# Altium schematic sheet MCU_STM32F446RE.SchDoc: STM32F446 CNC
size C; Author: AM; CompanyName: Expatria Technologies; DrawnBy: A.Marles; Engineer: AM; Organization: Expatria Technologies; DocumentNumber: 3; SheetNumber: 3; SheetTotal: 14
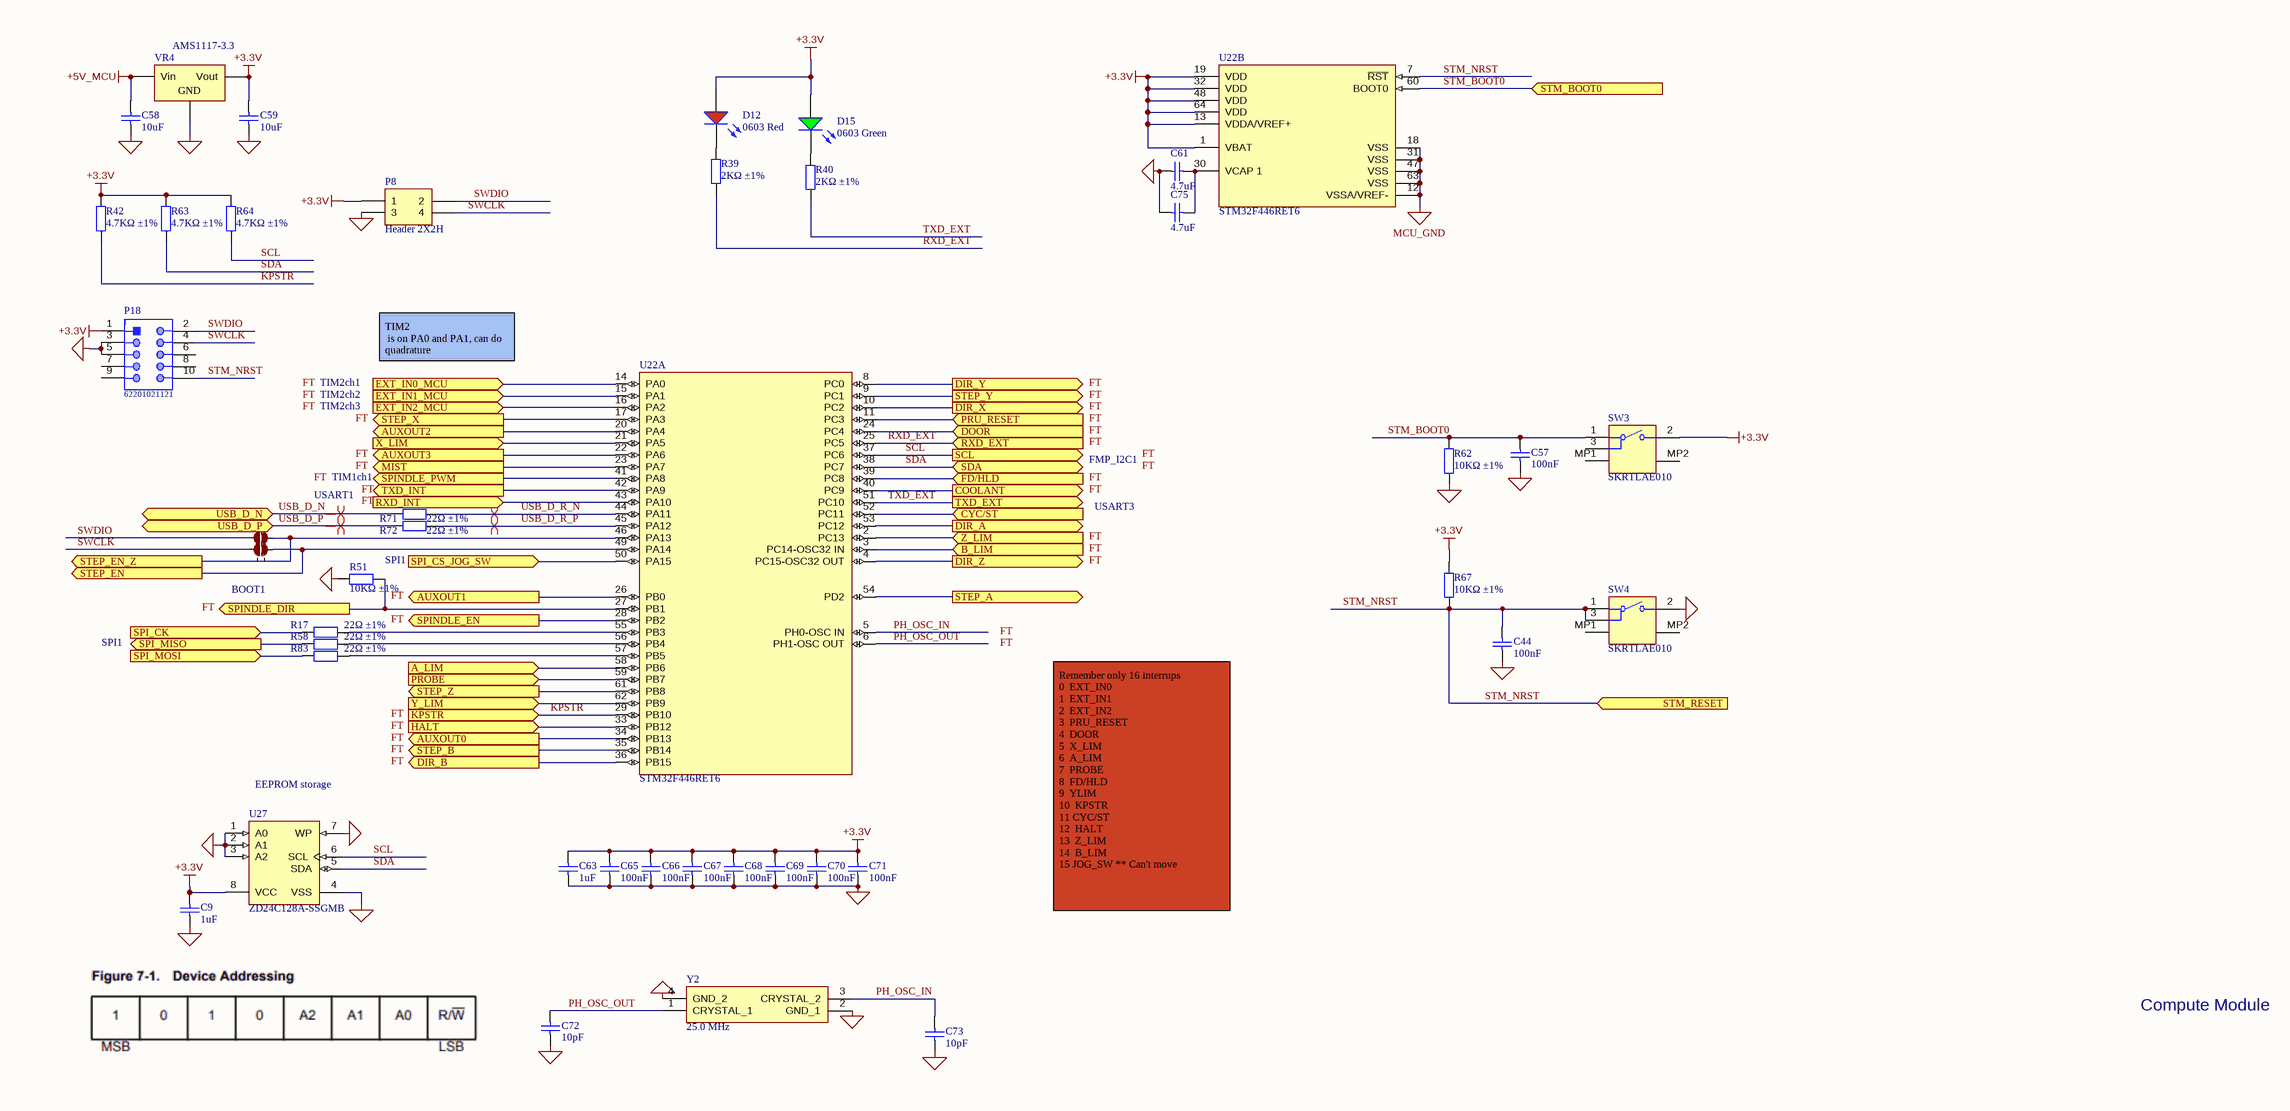
[diagram p0: MCU_STM32F446RE.SchDoc]

## Parts
C9  1uF  [0603_C]
C44  100nF  [0603_C]
C57  100nF  [0603_C]
C58  10uF  [1206_C]
C59  10uF  [1206_C]
C61  4.7uF  [0603_C]
C63  1uF  [0603_C]
C65  100nF  [0603_C]
C66  100nF  [0603_C]
C67  100nF  [0603_C]
C68  100nF  [0603_C]
C69  100nF  [0603_C]
C70  100nF  [0603_C]
C71  100nF  [0603_C]
C72  10pF  [0603_C]
C73  10pF  [0603_C]
C75  4.7uF  [0603_C]
D12  0603 Red  [0603_LED_S1]
D15  0603 Green  [0603_LED_S1]
J10  2 way net solder junction - Normally Open  [2waySolder_NO]  (value not drawn)  (no BOM)
J11  2 way net solder junction - Normally Open  [2waySolder_NO]  (value not drawn)  (no BOM)
P8  Header 2X2H  [HDR2X2H]  (no BOM)
P18  62201021121  [62201021121]  (no BOM)
R17  22Ω ±1%  [0603_R]
R39  2KΩ ±1%  [0603_R]
R40  2KΩ ±1%  [0603_R]
R42  4.7KΩ ±1%  [0603_R]
R51  10KΩ ±1%  [0603_R]
R58  22Ω ±1%  [0603_R]
R62  10KΩ ±1%  [0603_R]
R63  4.7KΩ ±1%  [0603_R]
R64  4.7KΩ ±1%  [0603_R]
R67  10KΩ ±1%  [0603_R]
R71  22Ω ±1%  [0603_R]
R72  22Ω ±1%  [0603_R]
R83  22Ω ±1%  [0603_R]
SW3  SKRTLAE010  [ALPS-SKRTLAE010_V]
SW4  SKRTLAE010  [ALPS-SKRTLAE010_V]
U22  STM32F446RET6  [FP-LQFP64-5W-IPC_B]  (parts A,B of 2)
U27  ZD24C128A-SSGMB  [SOIC-SN8_L]
VR4  AMS1117-3.3  [SOT-223]
Y2  25.0 MHz  [YSX321SL]

## Ports
A_LIM (in), AUXOUT0 (out), AUXOUT1 (out), AUXOUT2 (out), AUXOUT3 (out), B_LIM (in), COOLANT (out), CYC/ST (in), DIR_A (out), DIR_B (out), DIR_X (out), DIR_Y (out), DIR_Z (out), DOOR (in), EXT_IN0_MCU (in), EXT_IN1_MCU (in), EXT_IN2_MCU (in), FD/HLD (in), HALT (in), KPSTR (in), MIST (out), PROBE (in), PRU_RESET (in), RXD_EXT (in), RXD_INT (in), SCL (out), SDA (bidir), SPI_CK (in), SPI_CS_JOG_SW (in), SPI_MISO (out), SPI_MOSI (in), SPINDLE_DIR (out), SPINDLE_EN (out), SPINDLE_PWM (out), STEP_A (out), STEP_B (out), STEP_EN (out), STEP_EN_Z (out), STEP_X (out), STEP_Y (out), STEP_Z (out), STM_BOOT0 (in), STM_RESET (in), TXD_EXT (out), TXD_INT (out), USB_D_N (bidir), USB_D_P (bidir), X_LIM (in), Y_LIM (in), Z_LIM (in)

## Nets
+3.3V: C9.2 C59.2 C63.2 C65.2 C66.2 C67.2 C68.2 C69.2 C70.2 C71.2 D12.A D15.A P8.1 P18.1 R42.2 R63.2 R64.2 R67.1 SW3.2 U22.1(VBAT) U22.13(VDDA/VREF+) U22.19(VDD) U22.32(VDD) U22.48(VDD) U22.64(VDD) U27.8(VCC) VR4.2(Vout)
+5V_MCU: C58.2 VR4.3(Vin)
MCU_GND: C9.1 C44.1 C57.1 C58.1 C59.1 C61.1 C63.1 C65.1 C66.1 C67.1 C68.1 C69.1 C70.1 C71.1 C72.1 C73.1 C75.1 P8.3 P18.3 P18.5 R51.1 R62.2 SW4.2 U22.12(VSSA/VREF-) U22.18(VSS) U22.31(VSS) U22.47(VSS) U22.63(VSS) U27.1(A0) U27.2(A1) U27.3(A2) U27.4(VSS) U27.7(WP) VR4.1(GND) Y2.2(GND_1) Y2.4(GND_2)
A_LIM: U22.58(PB6) ; port A_LIM
AUXOUT0: U22.34(PB13) ; port AUXOUT0
AUXOUT1: U22.26(PB0) ; port AUXOUT1
AUXOUT2: U22.20(PA4) ; port AUXOUT2
AUXOUT3: U22.22(PA6) ; port AUXOUT3
B_LIM: U22.3(PC14-OSC32_IN) ; port B_LIM
COOLANT: U22.40(PC9) ; port COOLANT
CYC/ST: U22.52(PC11) ; port CYC/ST
DIR_A: U22.53(PC12) ; port DIR_A
DIR_B: U22.36(PB15) ; port DIR_B
DIR_X: U22.10(PC2) ; port DIR_X
DIR_Y: U22.8(PC0) ; port DIR_Y
DIR_Z: U22.4(PC15-OSC32_OUT) ; port DIR_Z
DOOR: U22.24(PC4) ; port DOOR
EXT_IN0_MCU: U22.14(PA0) ; port EXT_IN0_MCU
EXT_IN1_MCU: U22.15(PA1) ; port EXT_IN1_MCU
EXT_IN2_MCU: U22.16(PA2) ; port EXT_IN2_MCU
FD/HLD: U22.39(PC8) ; port FD/HLD
HALT: U22.33(PB12) ; port HALT
KPSTR: R42.1 U22.29(PB10) ; port KPSTR
MIST: U22.23(PA7) ; port MIST
PH_OSC_IN: C73.2 U22.5(PH0-OSC_IN) Y2.3(CRYSTAL_2)
PH_OSC_OUT: C72.2 U22.6(PH1-OSC_OUT) Y2.1(CRYSTAL_1)
PROBE: U22.59(PB7) ; port PROBE
PRU_RESET: U22.11(PC3) ; port PRU_RESET
RXD_EXT: R39.1 U22.25(PC5) ; port RXD_EXT
RXD_INT: U22.43(PA10) ; port RXD_INT
SCL: R64.1 U22.37(PC6) U27.6(SCL) ; port SCL
SDA: R63.1 U22.38(PC7) U27.5(SDA) ; port SDA
SPI_CK: R17.2 ; port SPI_CK
SPI_CS_JOG_SW: U22.50(PA15) ; port SPI_CS_JOG_SW
SPI_MISO: R58.2 ; port SPI_MISO
SPI_MOSI: R83.2 ; port SPI_MOSI
SPINDLE_DIR: R51.2 U22.27(PB1) ; port SPINDLE_DIR
SPINDLE_EN: U22.28(PB2) ; port SPINDLE_EN
SPINDLE_PWM: U22.41(PA8) ; port SPINDLE_PWM
STEP_A: U22.54(PD2) ; port STEP_A
STEP_B: U22.35(PB14) ; port STEP_B
STEP_EN: J11.2 U22.49(PA14) ; port STEP_EN
STEP_EN_Z: J10.2 U22.46(PA13) ; port STEP_EN_Z
STEP_X: U22.17(PA3) ; port STEP_X
STEP_Y: U22.9(PC1) ; port STEP_Y
STEP_Z: U22.61(PB8) ; port STEP_Z
STM_BOOT0: C57.2 R62.1 SW3.1 U22.60(BOOT0) ; port STM_BOOT0
STM_NRST: C44.2 P18.10 R67.2 SW4.1 SW4.3 U22.7(~{RST}) ; port STM_RESET
SWCLK: J11.1 P8.4 P18.4
SWDIO: J10.1 P8.2 P18.2
TXD_EXT: R40.1 U22.51(PC10) ; port TXD_EXT
TXD_INT: U22.42(PA9) ; port TXD_INT
USB_D_N: R71.2 ; port USB_D_N
USB_D_P: R72.2 ; port USB_D_P
USB_D_R_N: R71.1 U22.44(PA11)
USB_D_R_P: R72.1 U22.45(PA12)
X_LIM: U22.21(PA5) ; port X_LIM
Y_LIM: U22.62(PB9) ; port Y_LIM
Z_LIM: U22.2(PC13) ; port Z_LIM
NetC61_2: C61.2 C75.2 U22.30(VCAP_1)
NetD12_K: D12.K R39.2
NetD15_K: D15.K R40.2
NetR17_1: R17.1 U22.55(PB3)
NetR58_1: R58.1 U22.56(PB4)
NetR83_1: R83.1 U22.57(PB5)

Not connected (* = marked no-connect by the designer): P18 6 7 8 9; SW3 3 MP1 MP2; SW4 MP1 MP2

## Layout directives
differential pair: USB_D_N, USB_D_P, USB_D_R_N, USB_D_R_P

## Notes on the sheet
- TIM2
  is on PA0 and PA1, can do quadrature
- FT
- TIM2ch1
- TIM2ch2
- TIM2ch3
- TIM1ch1
- FMP_I2C1
- USART1
- USART3
- BOOT1
- (near R51) SPI1
- (near R51) FT
- SPI1
- (near U27) EEPROM storage
- Remember only 16 interrups
  0  EXT_IN0
  1  EXT_IN1
  2  EXT_IN2
  3  PRU_RESET
  4  DOOR
  5  X_LIM
  6  A_LIM
  7  PROBE
  8  FD/HLD
  9  YLIM
  10  KPSTR
  11 CYC/ST
  12  HALT
  13  Z_LIM
  14  B_LIM
  15 JOG_SW ** Can't move
- Compute Module
- Expatria Technologies
- SHEET
- PROJECT
- REV
- 1136 Glade Court
- Port Coquitlam, BC V3B 1R5
- EMAIL: INFO@EXPATRIA.CA
- SIZE
- ENGR
- C
- MODIFIED
- DOCUMENT
- /
- Copyright Expatria Technologies 2021.  This document describes Open Hardware and is licensed under the CERN-OHL-P  v2.  No warranty is implied or expressed.

## Library data of the parts
C9 C63 = 0603 1uF (105) 10% 50V: Chip capacitors; Manufacturer: Samsung Electro-Mechanics; PartNumber: CL10A105KB8NNNC; Tolerance: 10%; Voltage: 50V; Package: 0603; Supplier: LC; SuppliersPartNumber: C15849; Capacitance: 1uF; ComponentLink1Description: Supplier link; ComponentLink1URL: http://www.szlcsc.com/product/details_16531.html
C44 C57 C65-C71 = 0603 100nF (104) 10% 50V: Chip capacitors; Manufacturer: YAGEO; PartNumber: CC0603KRX7R9BB104; Tolerance: 10%; Voltage: 50V; ComponentLink1Description: Supplier link; ComponentLink1URL: http://www.szlcsc.com/product/details_15331.html; Package: 0603; Supplier: LC; SuppliersPartNumber: C14663; Capacitance: 100nF
C58 C59 = 1206 10uF (106) 10% 50V: Chip capacitors; Manufacturer: Samsung Electro-Mechanics; PartNumber: CL31A106KBHNNNE; Tolerance: 10%; Voltage: 50V; ComponentLink1Description: Supplier link; ComponentLink1URL: http://www.szlcsc.com/product/details_14236.html; Package: 1206; Supplier: LC; SuppliersPartNumber: C13585; Capacitance: 10uF; Manufacturer 1: Samsung Electro-Mechanics
C61 C75 = 0603 4.7uF (475) 10% 16V: Chip capacitors; Manufacturer: Samsung Electro-Mechanics; PartNumber: CL10A475KO8NNNC; Tolerance: 10%; Voltage: 16V; ComponentLink1Description: Supplier link; ComponentLink1URL: http://www.szlcsc.com/product/details_20375.html; Package: 0603; Supplier: LC; SuppliersPartNumber: C19666; Capacitance: 4.7uF
C72 C73 = 0603 10pF (100) 5% 50V: Chip capacitors; Manufacturer: Samsung Electro-Mechanics; PartNumber: CL10C100JB8NNNC; Tolerance: 5%; Voltage: 50V; ComponentLink1Description: Supplier link; ComponentLink1URL: http://www.szlcsc.com/product/details_1986.html; Package: 0603; Supplier: LC; SuppliersPartNumber: C1634; Capacitance: 10pF
D12 = 0603 LED Red: LED; ComponentLink1Description: 供应商链接; ComponentLink1URL: http://www.szlcsc.com/product/details_2659.html; Package: 0603; Supplier: LC; SuppliersPartNumber: C2286; Color: Red
D15 = 0603 LED Green: LED; ComponentLink1Description: 供应商链接; ComponentLink1URL: http://www.szlcsc.com/product/details_73152.html; Package: 0603; Supplier: LC; SuppliersPartNumber: C72043; Color: Green
J10 J11 = 2waySolderNO: ComponentLink1URL: http://www.edatools.cz/addons; ComponentLink1Description: Source
P8 = Header 2X2H: Header, 2-Pin, Dual row, Right Angle; LatestRevisionDate: 17-Jul-2002; LatestRevisionNote: Re-released for DXP Platform.; Publisher: Altium Limited; SuppliersPartNumber: C66690
P18 = CMP-1502-00948-1: THT Vertical Pin Header WR-PHD, Pitch 1.27 mm, Dual Row, 10 pins; Manufacturer: Wurth Elektronik; Rated Current: 1A; Pin Number: 10; Working Voltage: 100VAC; Contact Resistance: 20mOhm; Withstanding Voltage: 500VAC; Pitch: 1.27mm; Gender: Male; Mounting Technology: THT; Manufacturer URL: http://www.we-online.de; Package Reference: 62201021121; Row Number: Dual; Datasheet URL: https://katalog.we-online.de/em/datasheet/62201021121.pdf; Publisher: WurthElektronik; Packaging: Box; Operating Temperature: -40to105degC; Orientation: Vertical; Part Number: 62201021121
R17 R58 R71 R72 R83 = 0603 22R (22R0) 1%: Chip resistor; Manufacturer: Uniroyal Elec; PartNumber: 0603WAF220JT5E; Power: 1/10W; ComponentLink1Description: Supplier link; ComponentLink1URL: http://www.szlcsc.com/product/details_24078.html; Package: 0603; Supplier: LC; SuppliersPartNumber: C23345; Resistance: 22Ω; Tolerance: 1%
R39 R40 = 0603 2K (2001) 1%: Chip resistor; Manufacturer: Uniroyal Elec; PartNumber: 0603WAF2001T5E; Power: 1/10W; ComponentLink1Description: Supplier link; ComponentLink1URL: http://www.szlcsc.com/product/details_23702.html; Package: 0603; Supplier: LC; SuppliersPartNumber: C22975; Resistance: 2KΩ; Tolerance: 1%
R42 R63 R64 = 0603 4.7K (4701) 1%: Chip resistor; Manufacturer: Uniroyal Elec; PartNumber: 0603WAF4701T5E; Power: 1/10W; ComponentLink1Description: Supplier link; ComponentLink1URL: http://www.szlcsc.com/product/details_23889.html; Package: 0603; Supplier: LC; SuppliersPartNumber: C23162; Resistance: 4.7KΩ; Tolerance: 1%
R51 R62 R67 = 0603 10K (1002) 1%: Chip resistor; Manufacturer: Uniroyal Elec; PartNumber: 0603WAF1002T5E; Power: 1/10W; ComponentLink1Description: Supplier link; ComponentLink1URL: http://www.szlcsc.com/product/details_26547.html; Package: 0603; Supplier: LC; SuppliersPartNumber: C25804; Resistance: 10KΩ; Tolerance: 1%
SW3 SW4 = CMP-2000-07073-2: Side Push Type, 250 V, -40 to 90 degC, 3-Pin SMD, RoHS, Tape and Reel; Manufacturer: ALPS; Operating Force: 1.6N; Folder: Unified Components\Components\New Releases\New\; Maximum Current Rating: 0.05@12VDCA; RevisionId: 1; Pole Throw Configuration: SPST; Switch Configuration: N.O.; AccessRights: 2147483647; Maximum DC Voltage Rating: 12V; ContentType: Unified Component; Rad Hard: No; Mounting: SurfaceMount; Datasheet URL: http://www.alps.com/prod/info/E/PDF/Tact/SurfaceMount/SKRT/SKRT.PDF; Manufacturer URL: http://www.alps.com/e/; ReleaseDate: 22/09/2017 06:13:25 AM; ItemHRID: CMP-2000-07073; ContentTypeGUID: CB3C11C4-E317-11DF-B822-12313F0024A2; LifeCycle: Released; ItemGUID: EAC55BEC-37DC-4BDB-8BA7-D75E6D5C3D75; Packaging: Tape&Reel; Package Reference: SKRTLAE010; FolderGUID: B7F4506A-9127-42E7-A087-46FE7B18D116; Datasheet Version: 06/2015; Mounting Technology: SurfaceMount; LifeCycleStateGUID: 61E382EE-6656-4F12-9E24-BE9327104A25; Package Description: 3-Pin Surface Mount Device, Body 4.5 x 3.55 mm, Pitch 1.225 mm; SuppliersPartNumber: C110293; Manufacturer 1: ALPS
U22 = STM32F446RET6: IC MCU 32BIT 512KB FLASH 64LQFP; Manufacturer: STMicroelectronics; Number Of Spi Channels: 4; Ram Size: 128KBytes; Standoff Height: 0.05mm; Number Of Uart Channels: 6; Number Of Pwm Channels: 32; Max Junction Temp: +105°C; Number Of I/Os: 50; Number Of Usb Channels: 2; Frequency: 180MHz; Number Of A/D Converters: 3; Max Supply Voltage: 3.6V; Number Of Adc Channels: 16; Interface: I2C,SPI,UART,USART,CAN,USB,LIN,IrDA,I2S,Other; Memory Size: 512KBytes; Number Of Timers/Counters: 14; Min Supply Voltage: 1.7V; Core Architecture: ARM Cortex-M4; Data Bus Width: 32bits; Number Of Cores: 1; Consigned: Y; Ambient Temperature Range Low: -40°C; ComponentLink2URL: https://www.st.com/en/microcontrollers-microprocessors/stm32f446re.html; Category: IC; Height: 1.6mm; Ipc Land Pattern Name: QFP50P1200X1200X160-64; Octopart: https://octopart.com/stm32f446ret6-stmicroelectronics-52642920; Temperature Range High: +105°C; Lead Free: Yes; Mouser Description: ARM Microcontrollers - MCU High-performance and DSP with FP, ARM Cortex-M4 MCU with 512 Kbytes Flash, 180 MHz CPU, Art Accelerator, SDRAM; Digikey Description: IC MCU 32BIT 512KB FLASH 64LQFP; Ambient Temperature Range High: +85°C; Number Of I2C Channels: 4; Memory Type: FLASH; RoHS: TRUE; Automotive: No; Device Class L1: Integrated Circuits (ICs); Temperature: -40°C to +105°C; Device Class L2: Embedded Processors and Controllers; Device Class L3: Microcontrollers; Temperature Range Low: -40°C; Package: LQFP64-5W; ComponentLink2Description: Datasheet; Manufacturer 1: STMicroelectronics; Manufacturer Part Number 1: STM32F446RET6; SuppliersPartNumber: C69336
U27 = CMP-0159-00216-1: IC EEPROM 128KBIT I2C 8SOIC; SuppliersPartNumber: C918271
VR4 = SOT-223 AMS1117-3.3: Vout=3.3V 1A 72dB@(120Hz) (LDO); Manufacturer 1: AMS; ComponentLink1Description: 供应商链接; ComponentLink1URL: http://www.szlcsc.com/product/details_6652.html; Package: SOT-223; Supplier: LC; SuppliersPartNumber: C6186; Manufacturer Part Number 1: AMS1117-3.3
Y2 = YSX321SL: Crystal or Oscillator; Manufacturer_Name: Yangxing Tech; Manufacturer_Part_Number: X322525MSB4SI; Height: 0.8mm; SuppliersPartNumber: C13740